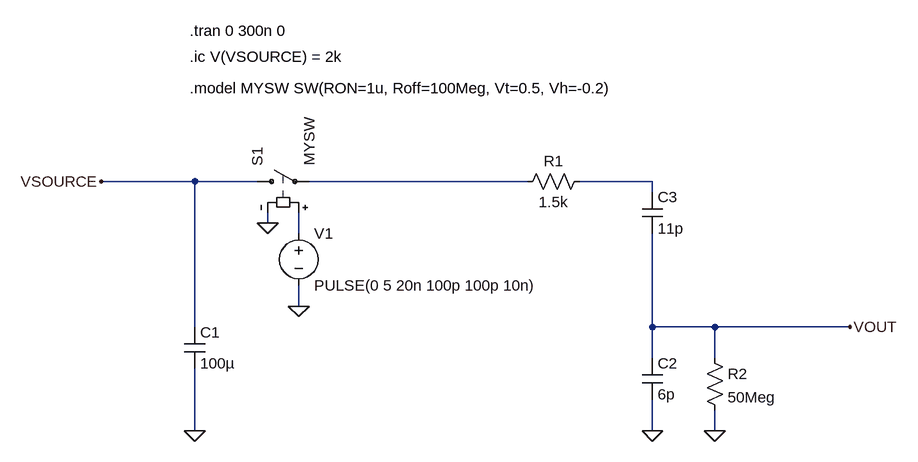
[diagram p0: schematic ESD_Testing.asc]
ESD_Testing.asc, the LTspice schematic file:
Version 4
SHEET 1 1008 680
WIRE -80 -192 -224 -192
WIRE 16 -192 -80 -192
WIRE 432 -192 96 -192
WIRE 624 -192 512 -192
WIRE 624 -176 624 -192
WIRE 32 -128 32 -144
WIRE 80 -112 80 -144
WIRE 80 0 80 -32
WIRE -80 32 -80 -192
WIRE 624 32 624 -112
WIRE 720 32 624 32
WIRE 928 32 720 32
WIRE 624 80 624 32
WIRE 720 80 720 32
WIRE -80 192 -80 96
WIRE 624 192 624 144
WIRE 720 192 720 160
FLAG -80 192 0
FLAG 624 192 0
FLAG 32 -128 0
FLAG 80 0 0
FLAG 720 192 0
FLAG 928 32 VOUT
FLAG -224 -192 VSOURCE
SYMBOL cap -96 32 R0
SYMATTR InstName C1
SYMATTR Value 100µ
SYMBOL res 528 -208 R90
WINDOW 0 0 56 VBottom 2
WINDOW 3 32 56 VTop 2
SYMATTR InstName R1
SYMATTR Value 1.5k
SYMBOL sw 0 -192 R270
SYMATTR InstName S1
SYMATTR Value MYSW
SYMBOL res 704 64 R0
SYMATTR InstName R2
SYMATTR Value 50Meg
SYMBOL cap 608 80 R0
SYMATTR InstName C2
SYMATTR Value 6p
SYMBOL voltage 80 -128 R0
WINDOW 123 0 0 Left 0
WINDOW 39 0 0 Left 0
SYMATTR InstName V1
SYMATTR Value PULSE(0 5 20n 100p 100p 10n)
SYMBOL cap 608 -176 R0
SYMATTR InstName C3
SYMATTR Value 11p
TEXT -88 -336 Left 2 !.model MYSW SW(RON=1u, Roff=100Meg, Vt=0.5, Vh=-0.2)
TEXT -88 -384 Left 2 !.ic V(VSOURCE) = 2k
TEXT -88 -424 Left 2 !.tran 0 300n 0

The netlist it stands for:
* ESD_Testing.asc
C1 VSOURCE 0 100µ
R1 N002 N001 1.5k
S1 VSOURCE N001 N003 0 MYSW
R2 VOUT 0 50Meg
C2 VOUT 0 6p
V1 N003 0 PULSE(0 5 20n 100p 100p 10n)
C3 N002 VOUT 11p
.model MYSW SW(RON=1u, Roff=100Meg, Vt=0.5, Vh=-0.2)
.ic V(VSOURCE) = 2k
.tran 0 300n 0
.backanno
.end